# EAGLE design MotorController_ToniDove_SwitchingPower (EAGLE 6.5.0)
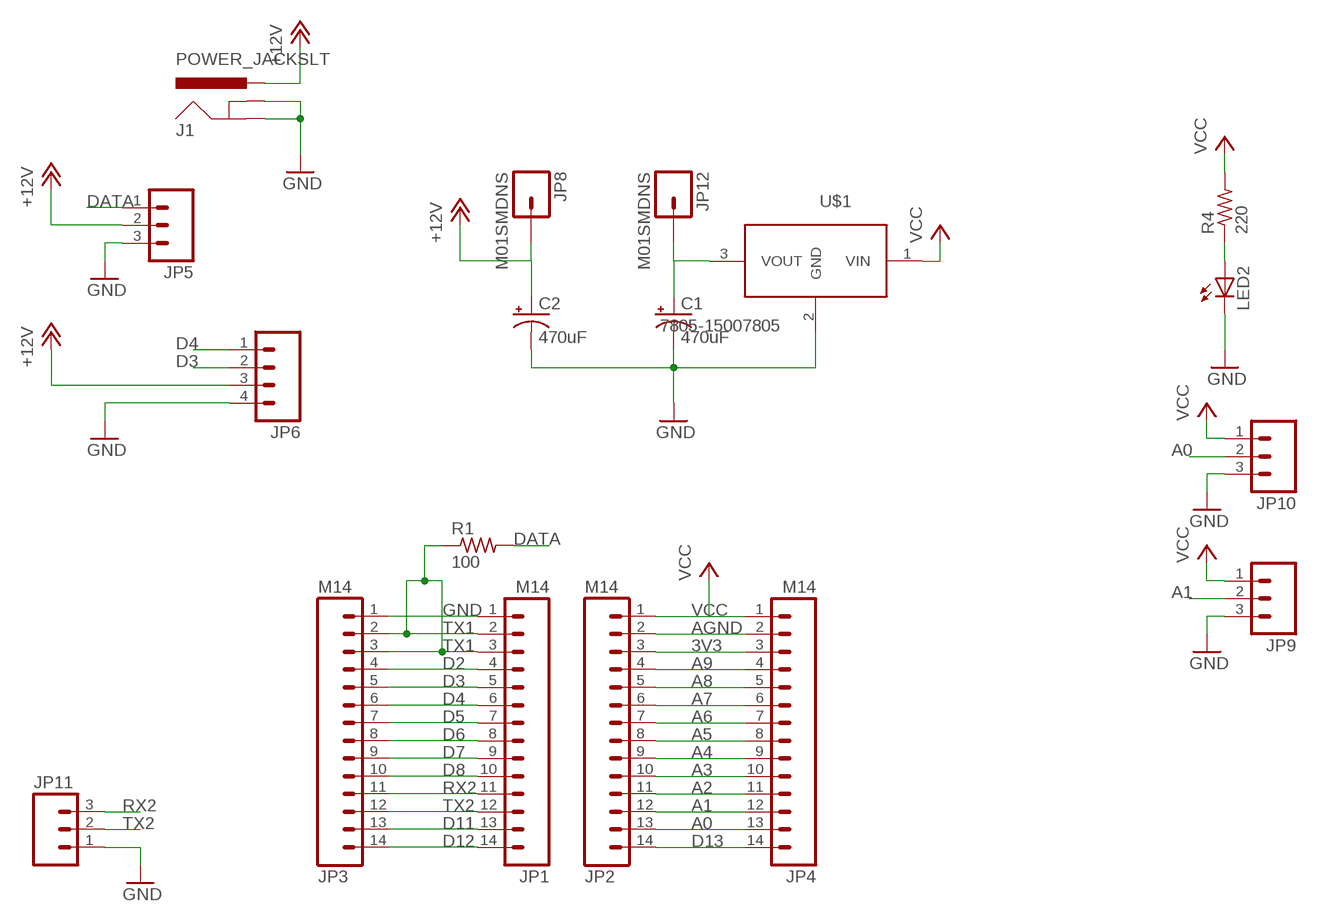
[diagram p0: schematic, sheet 1]

## Parts
C1  470uF  CPOL-USE5-13  [E5-13]
C2  470uF  CPOL-USE5-13  [E5-13]
J1  POWER_JACKSLT  [POWER_JACK_SLOT]
JP1  M14  [1X14]
JP2  M14  [1X14]
JP3  M14  [1X14]
JP4  M14  [1X14]
JP5  M03PTH  [1X03]
JP6  M04PTH  [1X04]
JP8  M01SMDNS  [1X01NS]
JP9  M03PTH  [1X03]
JP10  M03PTH  [1X03]
JP11  M03PTH  [1X03]
JP12  M01SMDNS  [1X01NS]
LED2  LED5MM  [LED5MM]
R1  100  R-US_0204/7  [0204/7]
R4  220  R-US_0204/7  [0204/7]
U$1  7805-15007805  [UL94-V0]

## Nets
3V3: JP2.3 JP4.3
+12V: C2.+ J1.PWR JP5.2 JP6.3 JP8.1
A0: JP2.13 JP4.13 JP10.2
A1: JP2.12 JP4.12 JP9.2
A2: JP2.11 JP4.11
A3: JP2.10 JP4.10
A4: JP2.9 JP4.9
A5: JP2.8 JP4.8
A6: JP2.7 JP4.7
A7: JP2.6 JP4.6
A8: JP2.5 JP4.5
A9: JP2.4 JP4.4
AGND: JP2.2 JP4.2
D2: JP1.4 JP3.4
D3: JP1.5 JP3.5 JP6.2
D4: JP1.6 JP3.6 JP6.1
D5: JP1.7 JP3.7
D6: JP1.8 JP3.8
D7: JP1.9 JP3.9
D8: JP1.10 JP3.10
D11: JP1.13 JP3.13
D12: JP1.14 JP3.14
D13: JP2.14 JP4.14
DATA: JP5.1 R1.2
GND: C1.- C2.- J1.GND@1(GNDBREAK) J1.GND@2(GND) JP1.1 JP3.1 JP5.3 JP6.4 JP9.3 JP10.3 JP11.1 LED2.K(C) U$1.2(GND)
N$2: LED2.A R4.1
N$6: C1.+ JP12.1 U$1.3(VOUT)
RX2: JP1.11 JP3.11 JP11.3
TX1: JP1.2 JP1.3 JP3.2 JP3.3 R1.1
TX2: JP1.12 JP3.12 JP11.2
VCC: JP2.1 JP4.1 JP9.1 JP10.1 R4.2 U$1.1(VIN)

## Library data of the parts
C1 C2 = rcl:CPOL-US: POLARIZED CAPACITOR, American symbol
J1 = SparkFun-Connectors:POWER_JACK: Power Jack This is the standard 5.5mm barrel jack for power. The PTH is the most common, proven, reliable, footprint. The Slot footprint only works if the mill layer is transmitted to the PCB fab house so be warned. Spark Fun Electronics SKU : PRT-00119 SMT: CONN-08106 Mating wall wart : TOL-00298 (and others)
JP1-JP4 = SparkFun-Connectors:M14: Header 14 Standard 14-pin 0.1" header. Use with straight break away headers (SKU : PRT-00116), right angle break away headers (PRT-00553), swiss pins (PRT-00743), machine pins (PRT-00117), and female headers (PRT-00115).
JP5 JP9-JP11 = SparkFun-Connectors:M03: Header 3 Standard 3-pin 0.1" header. Use with straight break away headers (SKU : PRT-00116), right angle break away headers (PRT-00553), swiss pins (PRT-00743), machine pins (PRT-00117), and female headers (PRT-00115). Molex polarized connector foot print use with SKU : PRT-08232 with associated crimp pins and housings.
JP6 = SparkFun-Connectors:M04: Header 4 Standard 4-pin 0.1" header. Use with straight break away headers (SKU : PRT-00116), right angle break away headers (PRT-00553), swiss pins (PRT-00743), machine pins (PRT-00117), and female headers (PRT-00115). Molex polarized connector foot print use with SKU : PRT-08231 with associated crimp pins and housings. 1MM SMD Version SKU: PRT-10208
JP8 JP12 = SparkFun-Connectors:M01: Header 1 Standard 1-pin 0.1" header. Use with straight break away headers (SKU : PRT-00116), right angle break away headers (PRT-00553), swiss pins (PRT-00743), machine pins (PRT-00117), and female headers (PRT-00115).
LED2 = SparkFun-LED:LED: LEDs Standard schematic elements and footprints for 5mm, 3mm, 1206, and 0603 sized LEDs. 5mm - Spark Fun Electronics SKU : COM-00529 (and others)
R1 R4 = rcl:R-US_: RESISTOR, American symbol
U$1 = EzerLonginus:7805-1500

## Board
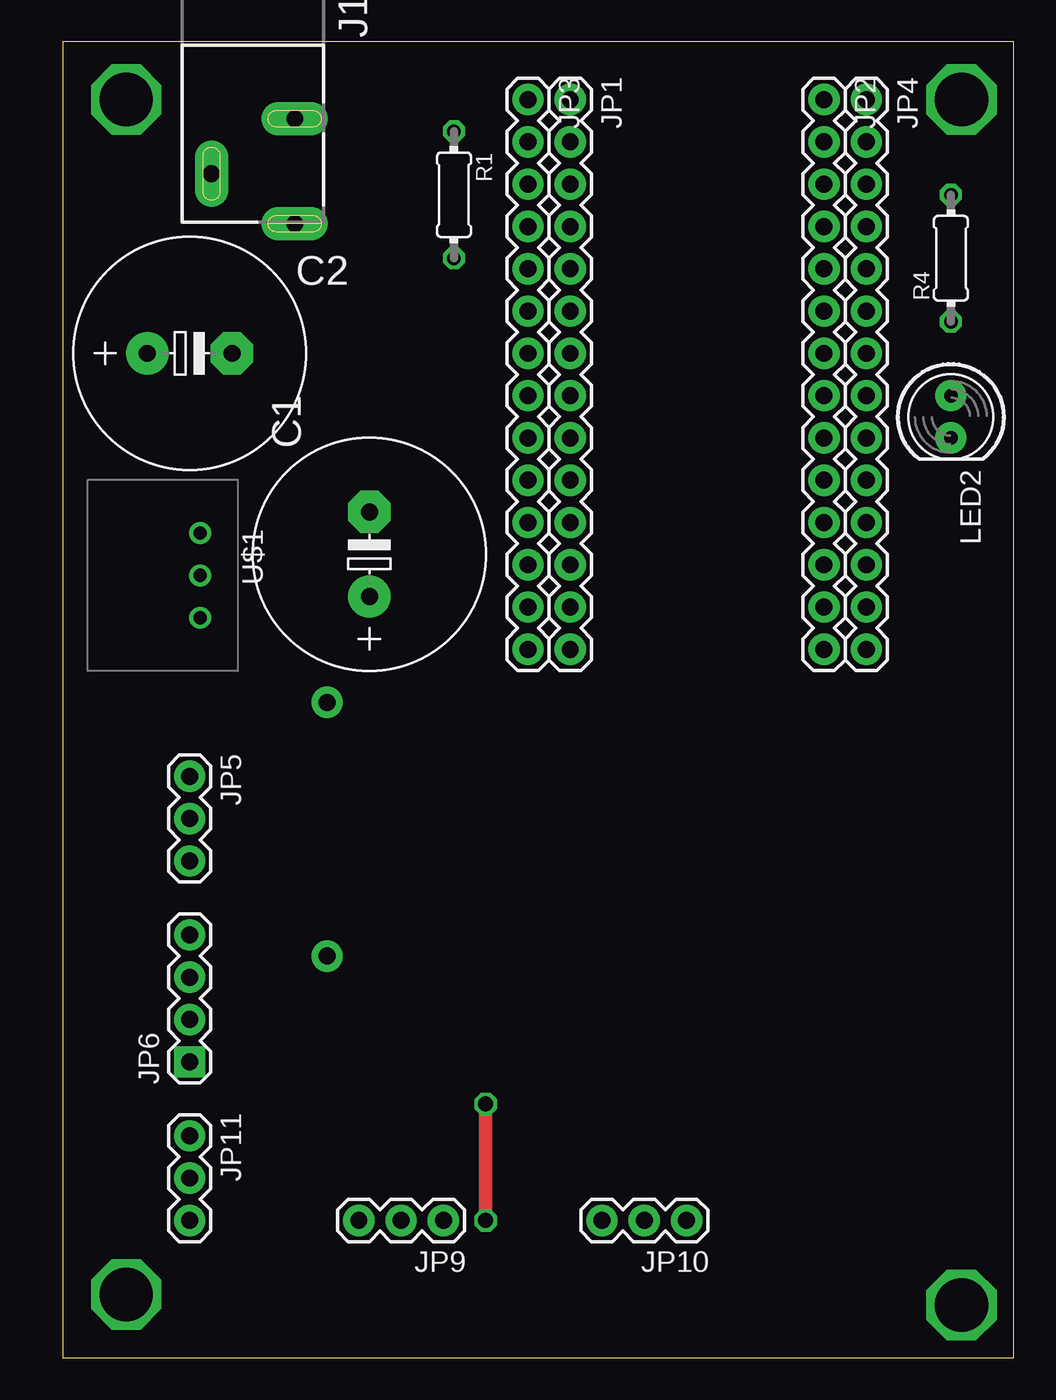
[diagram p1: board, top side]
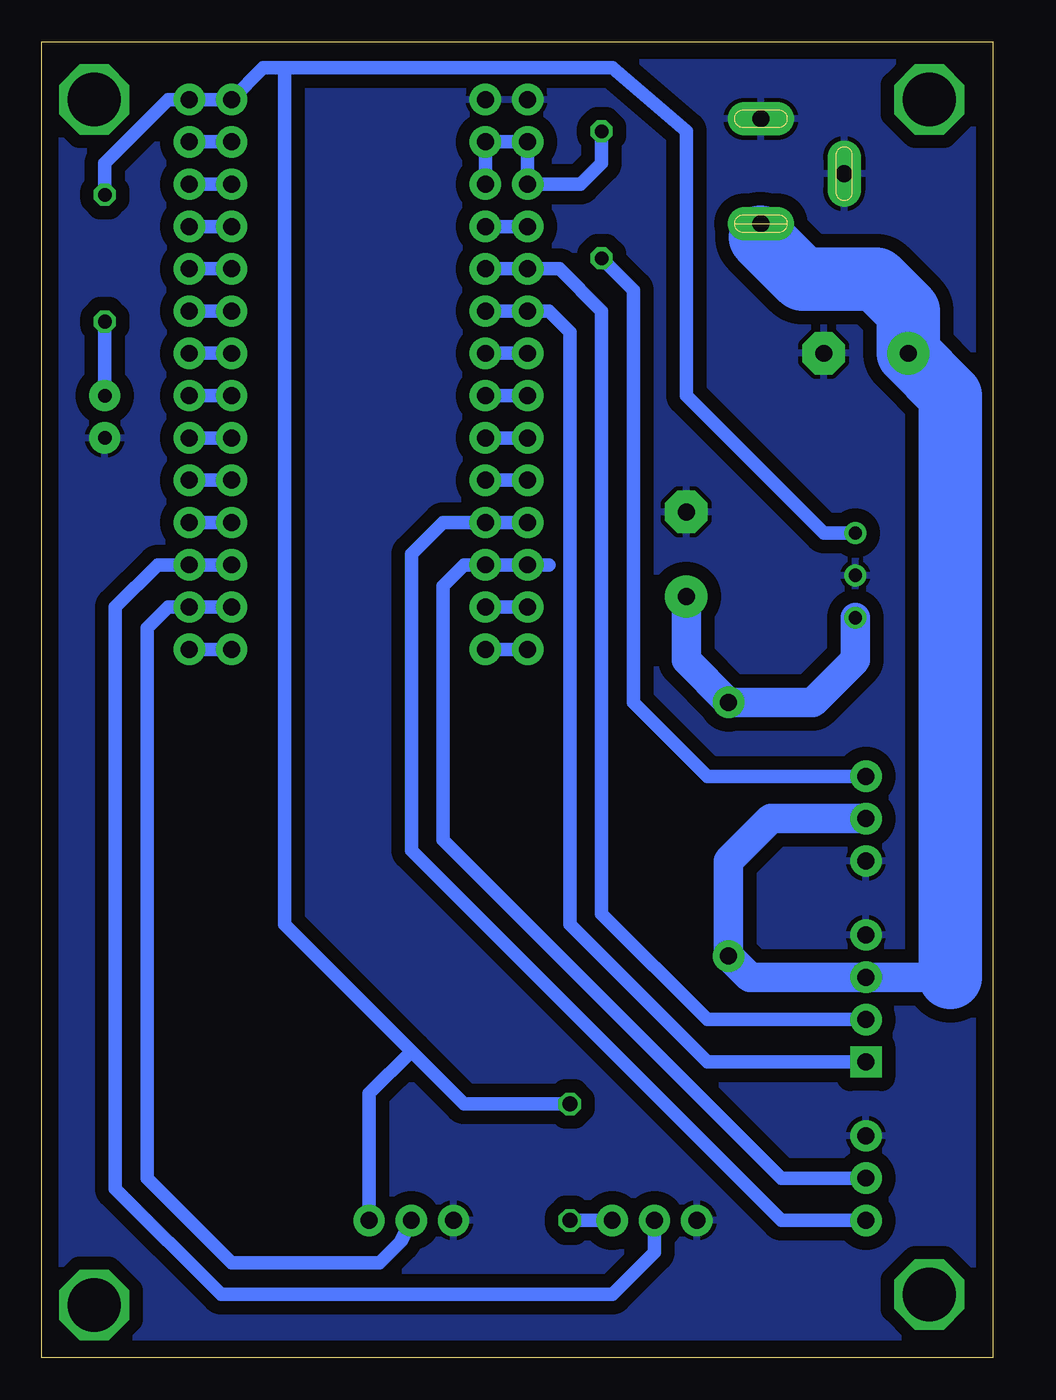
[diagram p2: board, bottom side, seen from below]

Size 57.13 x 79.05 mm. Coordinates in mm from the lower left corner, seen from the top.
Outline: 0,0 57.13,0 57.13,79.05 0,79.05 0,0
Copper layers (1*16): Top 0.035mm / dielectric 1.5mm / Bottom 0.035mm
Design rules "default": minimum track width 10mil, minimum drill 24mil, track to track 8mil, track to pad 8mil, pad to pad 8mil, via to via 8mil, smd to smd 8mil, copper to edge 40mil, drill to drill 8mil, minimum pad ring 10mil, minimum via ring 8mil, stop-mask expansion 4mil, vias tented up to drill 0mil, thermal gap 10mil

### Footprints (pad centres in the part's own frame; a part is rotated, then mirrored left to right if it is on the bottom)
E5-13 = drill 1.016 pad 2.54: + -2.54,0 | drill 1.016 pad 2.54 octagon: - 2.54,0
POWER_JACK_SLOT = drill 1 pad 2 long: GND@1 2.58,7.5; GND@2 7.58,10.8; PWR 2.58,13.8
1X14 = drill 1.016 pad 1.88: 1 0,0; 2 2.54,0; 3 5.08,0; 4 7.62,0; 5 10.16,0; 6 12.7,0; 7 15.24,0; 8 17.78,0; 9 20.32,0; 10 22.86,0; 11 25.4,0; 12 27.94,0; 13 30.48,0; 14 33.02,0
1X03 = drill 1.016 pad 1.88: 1 0,0; 2 2.54,0; 3 5.08,0
1X04 = drill 1.016 pad 1.88 square: 1 0,0 | drill 1.016 pad 1.88: 2 2.54,0; 3 5.08,0; 4 7.62,0
1X01NS = drill 1.016 pad 1.88: 1 0,0
LED5MM = drill 0.813 pad 1.88: A -1.27,0; K 1.27,0
0204/7 = drill 0.813 octagon: 1 -3.81,0; 2 3.81,0
UL94-V0 = drill 0.8: 1 -2.54,0; 2 0,0; 3 2.54,0

### Placement (x,y rotation side)
C1  18.41,48.26 90 top
C2  7.62,60.33 0 top
J1  16.51,81.92 180 top
JP1  30.48,75.56 270 top
JP2  45.72,75.56 270 top
JP3  27.94,75.56 270 top
JP4  48.26,75.56 270 top
JP5  7.62,34.92 270 top
JP6  7.62,17.78 90 top
JP8  15.88,24.13 0 top
JP9  22.86,8.26 180 top
JP10  37.47,8.26 180 top
JP11  7.62,13.34 270 top
JP12  15.88,39.37 0 top
LED2  53.34,56.52 270 top
R1  23.5,69.85 270 top
R4  53.34,66.04 90 top
U$1  8.26,46.99 270 top

### Tracks (layer width: path | path; a pad name or v marks a point on that pad's centre or on a via)
3V3
  Bottom 0.813: JP2.3 JP4.3
+12V
  Bottom 1.778: J1.PWR 13.93,67.35 13.97,67.31 | 2.54,22.86 JP6.3 14.61,22.86 JP8.1 15.88,29.84 13.34,32.38 JP5.2
  Bottom 3.81: 13.97,67.31 11.43,64.77 6.99,64.77 5.08,62.87 C2.+ 2.54,57.78 2.54,22.86
A0
  Bottom 0.813: JP4.13 JP2.13 49.53,45.09 50.8,43.81 50.8,10.79 45.72,5.71 36.83,5.71 35.56,6.99 JP10.2
A1
  Bottom 0.813: JP2.12 JP4.12 50.16,47.62 52.7,45.09 52.7,10.16 46.35,3.81 22.86,3.81 20.32,6.35 JP9.2
A2
  Bottom 0.813: JP2.11 JP4.11
A3
  Bottom 0.813: JP2.10 JP4.10
A4
  Bottom 0.813: JP2.9 JP4.9
A5
  Bottom 0.813: JP2.8 JP4.8
A6
  Bottom 0.813: JP2.7 JP4.7
A7
  Bottom 0.813: JP2.6 JP4.6
A8
  Bottom 0.813: JP2.5 JP4.5
A9
  Bottom 0.813: JP2.4 JP4.4
AGND
  Bottom 0.813: JP2.2 JP4.2
D2
  Bottom 0.813: JP3.4 JP1.4
D3
  Bottom 0.813: JP1.5 JP3.5 26.04,65.41 23.5,62.87 23.5,26.67 17.14,20.32 JP6.2
D4
  Bottom 0.813: JP1.6 JP3.6 26.67,62.87 25.4,61.59 25.4,26.04 17.14,17.78 JP6.1
D5
  Bottom 0.813: JP3.7 JP1.7
D6
  Bottom 0.813: JP3.8 JP1.8
D7
  Bottom 0.813: JP3.9 JP1.9
D8
  Bottom 0.813: JP3.10 JP1.10
D11
  Bottom 0.813: JP3.13 JP1.13
D12
  Bottom 0.813: JP3.14 JP1.14
D13
  Bottom 0.813: JP2.14 JP4.14
DATA
  Bottom 0.813: R1.2 21.59,64.14 21.59,39.37 17.46,35.24 17.14,34.92 JP5.1
GND
  pour Bottom (isolate 0.813): -0.64,78.74 57.15,78.74 57.15,0 -0.64,0
N$1  (via drill 3.2)
  other vias: 3.81,75.56
N$2
  Bottom 0.813: R4.1 LED2.A
N$3  (via drill 3.2)
  other vias: 3.81,3.81
N$4  (via drill 3.2)
  other vias: 53.98,75.56
N$5  (via drill 3.2)
  other vias: 53.98,3.17
N$6
  Bottom 1.778: C1.+ 18.41,41.91 JP12.1 10.79,39.37 8.26,41.91 U$1.3
RX2
  Bottom 0.813: JP3.11 JP1.11 33.02,50.16 34.92,48.26 34.92,30.48 12.7,8.26 JP11.3
TX1
  Bottom 0.813: JP1.3 JP1.2 JP3.2 JP3.3 24.77,70.48 23.5,71.75 R1.1
TX2
  Bottom 0.813: 26.67,47.62 JP3.12 JP1.12 31.75,47.62 33.02,46.35 33.02,31.11 12.7,10.79 JP11.2
VCC  (via drill 0.9)
  Top 0.813: v25.4,8.26 v25.4,15.24
  Bottom 0.813: 42.55,77.47 43.81,77.47 JP2.1 JP4.1 49.53,75.56 53.34,71.75 R4.2 | v25.4,15.24 31.75,15.24 34.92,18.41 | 34.92,18.41 42.55,26.04 42.55,77.47 | JP9.1 v25.4,8.26 | JP10.1 37.47,15.88 34.92,18.41 | 42.55,77.47 22.86,77.47 18.41,73.66 18.41,57.78 10.16,49.53 U$1.1